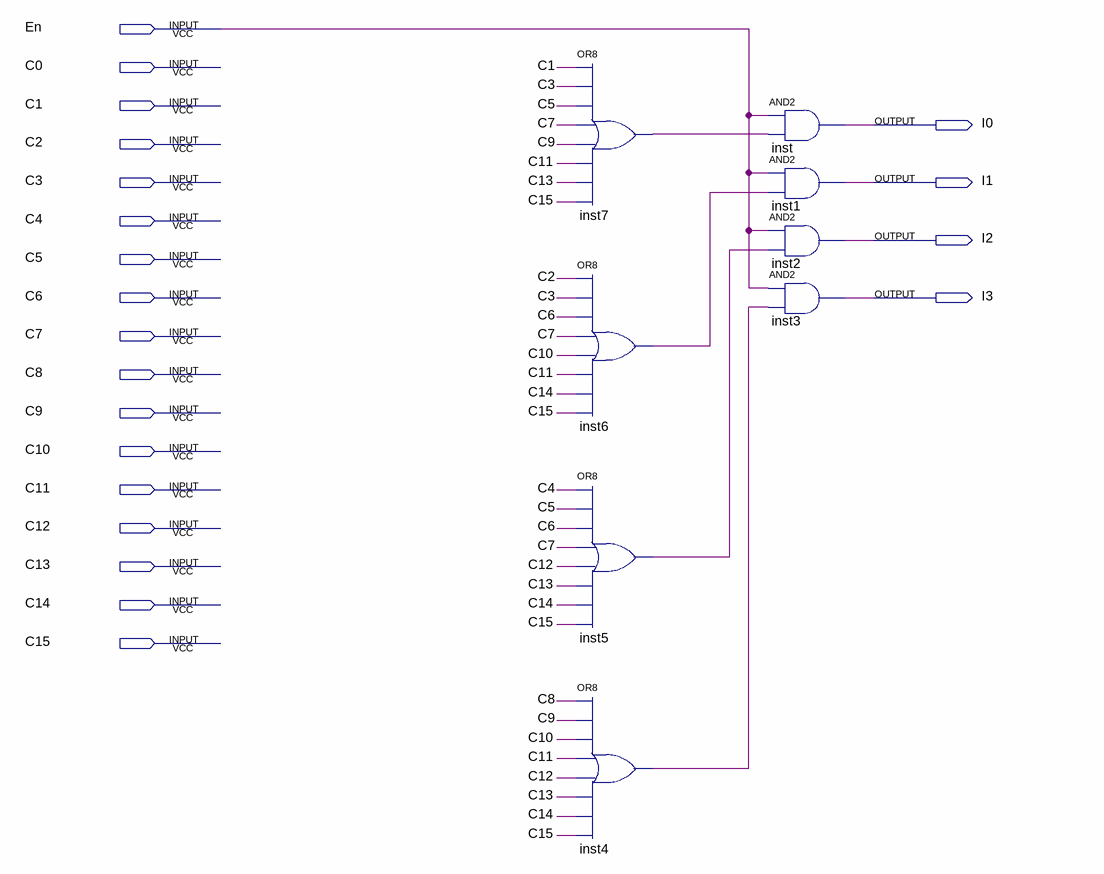
[diagram p0: schematic sheet]
// Quartus schematic CD16.bdf as structural Verilog: 8 symbols, 21 pins
module CD16 (
  input  En,
  input  C0,
  input  C1,
  input  C2,
  input  C3,
  input  C4,
  input  C5,
  input  C6,
  input  C7,
  input  C8,
  input  C9,
  input  C10,
  input  C11,
  input  C12,
  input  C13,
  input  C14,
  input  C15,
  output I0,
  output I1,
  output I2,
  output I3
);

  wire inst4_out, inst5_out, inst6_out, inst7_out;

  or inst7 (inst7_out, C1, C3, C5, C7, C9, C11, C13, C15);
  or inst6 (inst6_out, C2, C3, C6, C7, C10, C11, C14, C15);
  or inst5 (inst5_out, C4, C5, C6, C7, C12, C13, C14, C15);
  or inst4 (inst4_out, C8, C9, C10, C11, C12, C13, C14, C15);
  and inst (I0, En, inst7_out);
  and inst1 (I1, En, inst6_out);
  and inst2 (I2, En, inst5_out);
  and inst3 (I3, En, inst4_out);
endmodule
